# EAGLE design Callisto_RJ45_Test_Board (EAGLE 9.6.2)
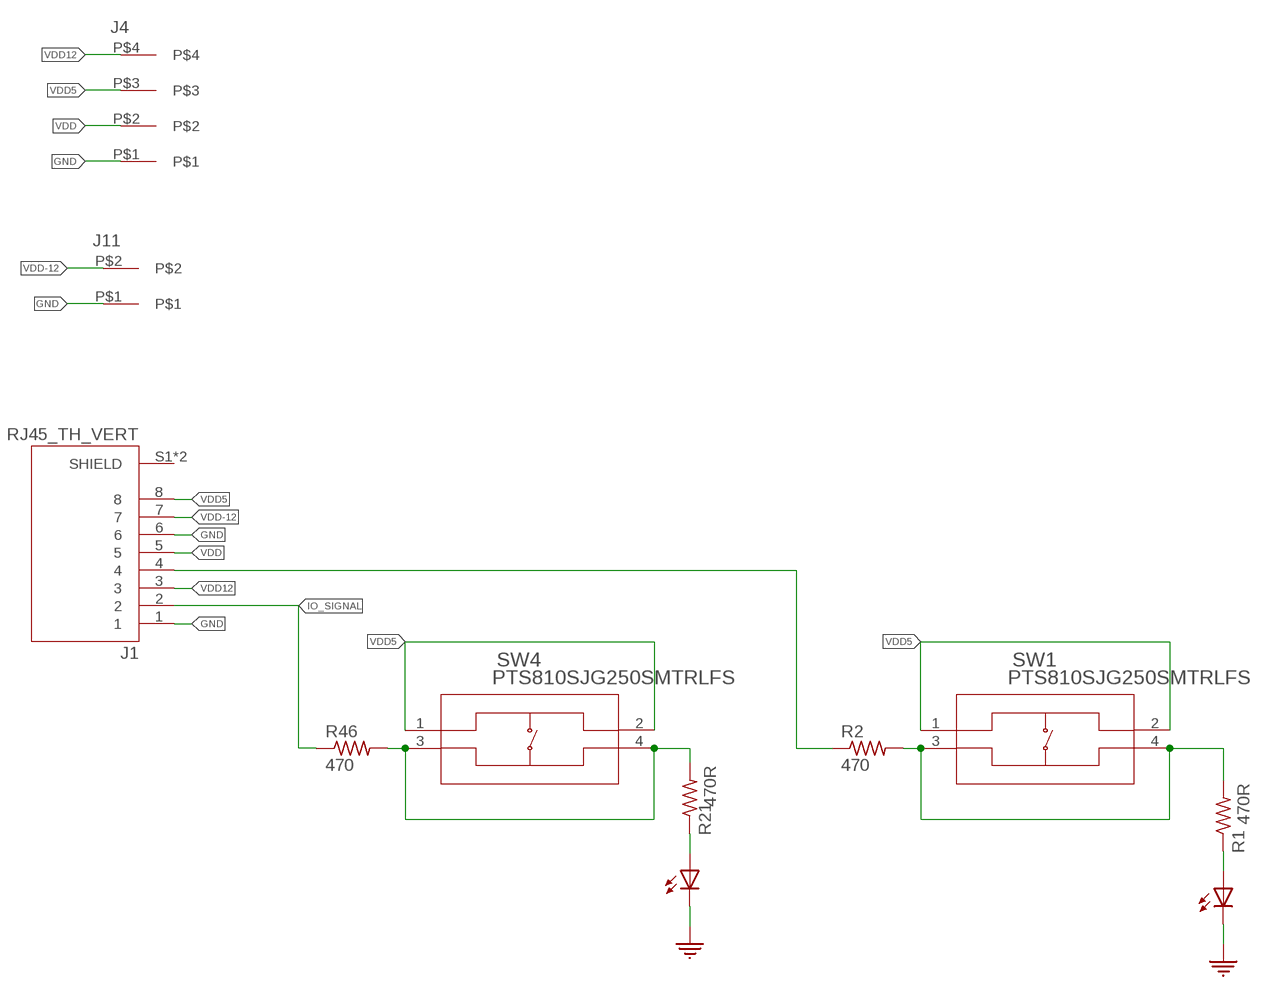
[diagram p0: schematic, sheet 1]

## Parts
J1  RJ45_TH_VERT  [ASSMANN_A-2014-2S-4-N-R]
J4  4-pos  3.81MM_1_X_4_RT_ANGLE_PLUG_HEADER  [1X4_3.81MM_PITCH]
J11  2-pos  3.81MM_1_X_2_RT_ANGLE_PLUG_HEADER  [2_3.81MM_PITCH]
LED1  Green  LED_0805_GREEN  [0805]
LED21  Green  LED_0805_GREEN  [0805]
R1  470R  R_0402  [0402]
R2  470  R_0402  [0402]
R21  470R  R_0402  [0402]
R46  470  R_0402  [0402]
SW1  PTS810SJG250SMTRLFS  [PTS810]
SW4  PTS810SJG250SMTRLFS  [PTS810]

## Nets
GND: J1.1 J1.6 J4.P$1 J11.P$1 LED1.2(C) LED21.2(C)
IO_SIGNAL: J1.2 R46.P$1
N$1: LED1.1(A) R1.P$1
N$2: R1.P$2 R2.P$2 SW1.3 SW1.4
N$37: J1.4 R2.P$1
N$41: LED21.1(A) R21.P$1
N$103: R21.P$2 R46.P$2 SW4.3 SW4.4
VDD: J1.5 J4.P$2
VDD5: J1.8 J4.P$3 SW1.1 SW1.2 SW4.1 SW4.2
VDD12: J1.3 J4.P$4
VDD-12: J1.7 J11.P$2
Unconnected: J1.S1(SHIELD) J1.S2(SHIELD)

## Library data of the parts
J1 = 3D_MIG_Controller:RJ45_TH_VERT: Jack Modular Connector 8p8c (RJ45, Ethernet) Vertical Shielded; DESCRIPTION: Jack Modular Connector 8p8c (RJ45, Ethernet) Vertical Shielded; DIGI-KEY_PART_NUMBER: AE10399-ND; MF: Assmann WSW Components; MP: A-2014-2S-4-N-R; PACKAGE: None
J4 = 3D_MIG_Controller:3.81MM_1_X_4_RT_ANGLE_PLUG_HEADER: 4 Position Terminal Block Header, Male Pins, Shrouded (4 Side) 0.150" (3.81mm) 90°, Right Angle - Through Hole; PARTNO: 691322310004
J11 = 3D_MIG_Controller:3.81MM_1_X_2_RT_ANGLE_PLUG_HEADER: TERM BLOCK HDR 2POS 90DEG 3.81MM; PARTNO: 691322310002
LED1 LED21 = 3D_MIG_Controller:LED_0805_GREEN: Green 570nm LED Indication - Discrete 2.2V 0805 (2012 Metric); PARTNO: LG R971-KN-1
R1 R2 R21 R46 = 3D_MIG_Controller:R_0402
SW1 SW4 = 3D_MIG_Controller:PTS810SJG250SMTRLFS; BUILT_BY: EMA_Cory; COPYRIGHT: Copyright (C) 2018 Accelerated Designs. All rights reserved; DATASHEET: https://www.ckswitches.com/products/tactile/PTS810/#PTS810SJG250SMTRLFS; MANUFACTURER_PART_NUMBER: PTS810SJG250SMTRLFS; VENDOR: C&K

## Board
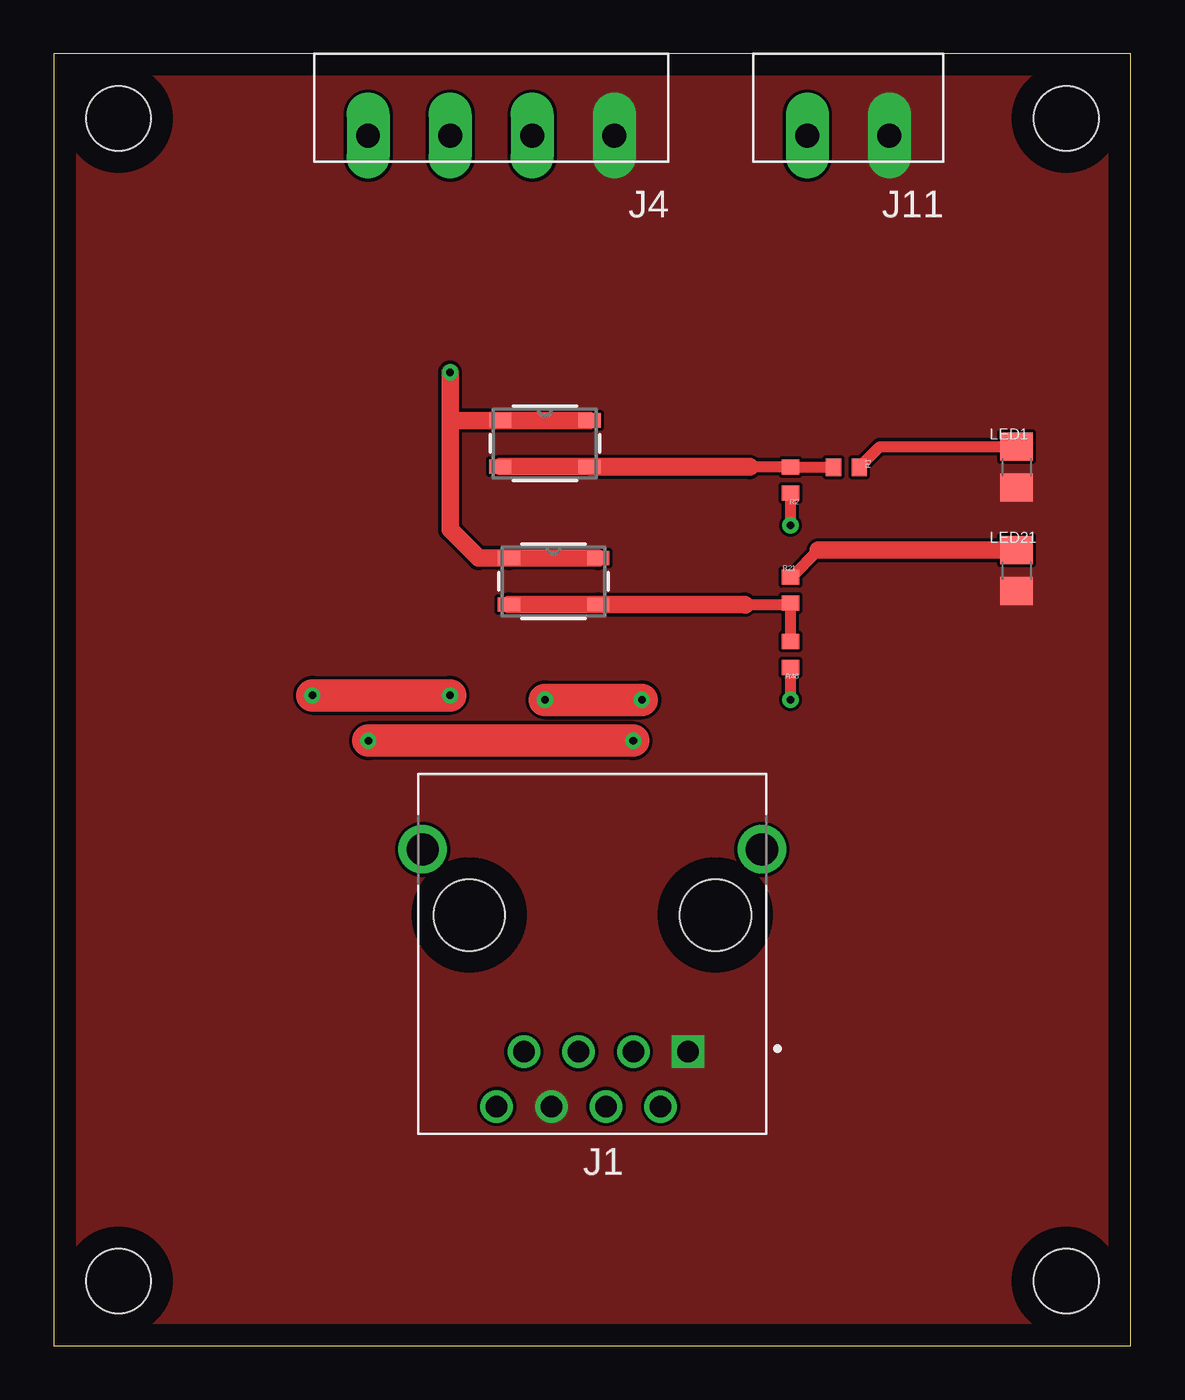
[diagram p1: board, top side]
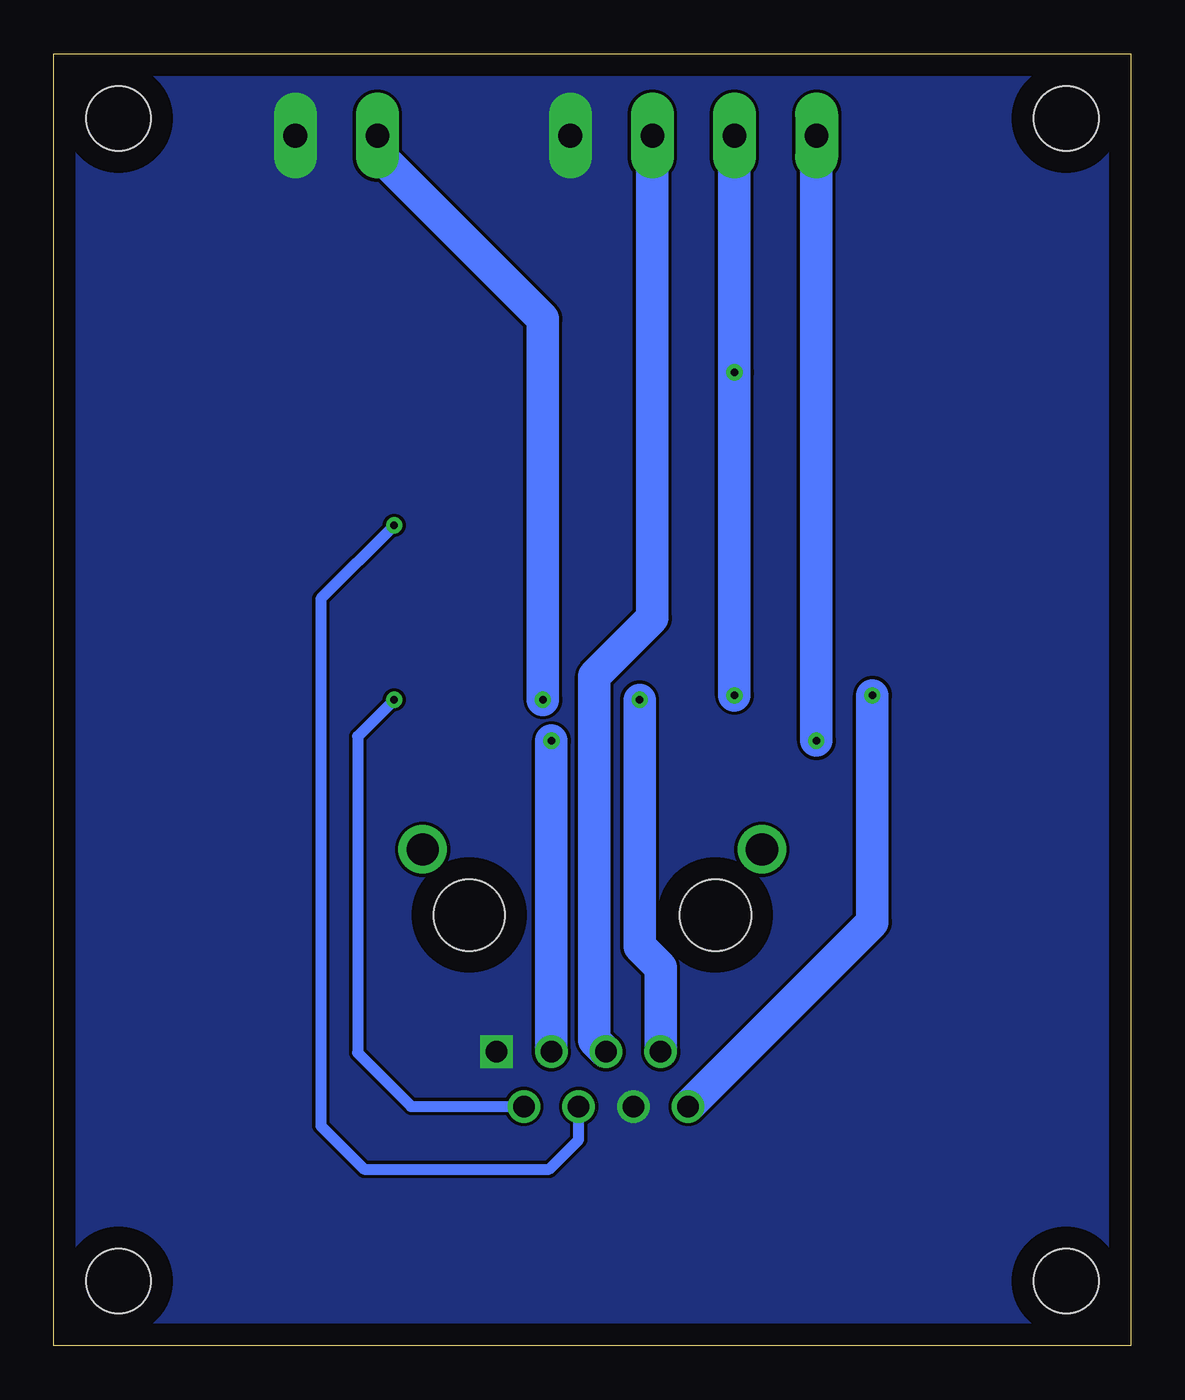
[diagram p2: board, bottom side, seen from below]

Size 50 x 60 mm. Coordinates in mm from the lower left corner, seen from the top.
Outline: 0,0 50,0 50,60 0,60 0,0
Copper layers (1*16): Top 0.035mm / dielectric 1.5mm / Bottom 0.035mm
Design rules "default": minimum track width 6mil, minimum drill 0.35mm, track to track 6mil, track to pad 6mil, pad to pad 6mil, via to via 6mil, smd to smd 6mil, copper to edge 40mil, drill to drill 6mil, minimum pad ring 10mil, minimum via ring 8mil, stop-mask expansion 4mil, vias tented up to drill 0mil, thermal gap 10mil
Holes 3 mm at 3,3 47,3 3,57 47,57

### Footprints (pad centres in the part's own frame; a part is rotated, then mirrored left to right if it is on the bottom)
ASSMANN_A-2014-2S-4-N-R = drill 1 square: 1 4.445,-6.35 | drill 1: 2 3.175,-8.89; 3 1.905,-6.35; 4 0.635,-8.89; 5 -0.635,-6.35; 6 -1.905,-8.89; 7 -3.175,-6.35; 8 -4.445,-8.89 | drill 1.5: S1 -7.875,3.05; S2 7.875,3.05 | hole 3.3: -5.715,0; 5.715,0
1X4_3.81MM_PITCH = drill 1.1 pad 2 long: P$1 0,0; P$2 3.81,0; P$3 7.62,0; P$4 11.43,0
2_3.81MM_PITCH = drill 1.1 pad 2 long: P$1 0,0; P$2 3.81,0
0805 = smd 1.3 x 1.5: 1 -0.95,0; 2 0.95,0
0402 = smd 0.8 x 0.7: P$1 0,0.6; P$2 0,-0.6
PTS810 = smd 1.041 x 0.66: 1 -2.075,1.075; 2 2.075,1.075; 3 -2.075,-1.075; 4 2.075,-1.075

### Placement (x,y rotation side)
J1  25,20 0 top
J4  26.02,56.2 180 top
J11  38.79,56.2 180 top
LED1  44.7,40.8 270 top
LED21  44.7,36 270 top
R1  36.8,40.8 270 top
R2  34.2,40.2 180 top
R21  34.2,35.1 0 top
R46  34.2,32.1 180 top
SW1  22.8,41.9 0 top
SW4  23.2,35.5 0 top

### Tracks (layer width: path | path; a pad name or v marks a point on that pad's centre or on a via)
GND
  pour Top (no thermals): 0,60 50,60 50,0 0,0
  pour Bottom (no thermals): 0,60 50,60 50,0 0,0
IO_SIGNAL  (via drill 0.35)
  Top 0.508: R46.P$1 v34.2,30
  Bottom 0.508: v34.2,30 35.9,28.3 35.9,13.6 33.41,11.11 J1.2
N$1
  Top 0.508: R1.P$1 38.35,41.75 LED1.1
N$2
  Top 0.508: R1.P$2 R2.P$2 34.17,40.83 32.3,40.83
  Top 0.813: SW1.3 SW1.4 32.3,40.83 32.3,40.8 24.9,40.8
N$37  (via drill 0.35)
  Top 0.508: R2.P$1 v34.2,38.1
  Bottom 0.508: v34.2,38.1 37.6,34.7 37.6,10.2 35.6,8.2 27,8.2 25.64,9.56 J1.4
N$41
  Top 0.508: R21.P$1 34.25,35.7 35.5,36.95
  Top 0.813: 35.5,36.95 LED21.1
N$103
  Top 0.508: 32.08,34.42 34.12,34.42 R21.P$2 R46.P$2
  Top 0.813: SW4.3 SW4.4 32.08,34.42 32.1,34.4
VDD
  Bottom 1.5: J1.5 24.9,14.19 24.9,31.1 22.21,33.79 J4.P$2
VDD5  (via drill 0.35)
  Top 0.813: SW4.2 SW4.1 19.73,36.58 18.4,37.9 18.4,43 | 18.4,43 v18.4,45.2 | SW1.2 SW1.1 18.43,42.98 18.4,43
  Top 1.5: v12,30.2 v18.4,30.2
  Bottom 1.5: J1.8 12,19.66 v12,30.2 | v18.4,30.2 v18.4,45.2 J4.P$3
VDD12  (via drill 0.35)
  Top 1.5: v26.9,28.1 v14.6,28.1
  Bottom 1.5: J1.3 v26.91,28.09 v26.9,28.1 | v14.6,28.1 14.6,56.34 J4.P$4
VDD-12  (via drill 0.35)
  Top 1.5: v22.8,30 v27.3,30
  Bottom 1.5: J1.7 21.82,17.56 22.81,18.54 22.81,21.46 22.8,21.46 v22.8,30 | v27.3,30 27.3,47.7 34.98,55.38 J11.P$2